# EAGLE design PIR_D205 (EAGLE 7.1.0)
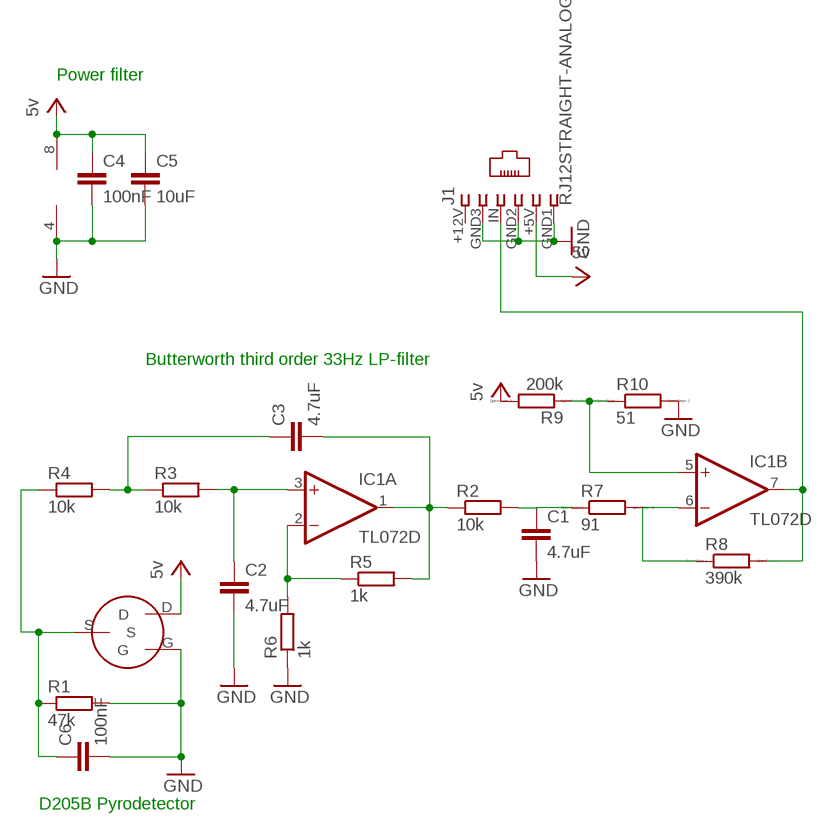
[diagram p0: schematic, sheet 1]

## Parts
C1  4.7uF  C-EUC1206  [C1206]
C2  4.7uF  C-EUC1206  [C1206]
C3  4.7uF  C-EUC1206  [C1206]
C4  100nF  C-EUC1206  [C1206]
C5  10uF  C-EUC1206  [C1206]
C6  100nF  C-EUC1206  [C1206]
IC1  TL072D  [SO08]
J1  RJ12STRAIGHT-ANALOG  [RJ12-STRAIGHT-ANALOG]
R1  47k  R-EU_R1206  [R1206]
R2  10k  R-EU_R0805  [R0805]
R3  10k  R-EU_R0805  [R0805]
R4  10k  R-EU_R0805  [R0805]
R5  1k  R-EU_R0805  [R0805]
R6  1k  R-EU_R0805  [R0805]
R7  91  R-EU_R1206  [R1206]
R8  390k  R-EU_R1206  [R1206]
R9  200k  R-EU_R1206  [R1206]
R10  51  R-EU_R1206  [R1206]
U$1  D205B  [TO5]

## Nets
GND: C1.2 C2.2 C4.2 C5.2 C6.2 IC1.4(P:V-) J1.GND1 J1.GND2 J1.GND3 R1.2 R6.1 R10.2 U$1.G
N$1: C6.1 R1.1 R4.1 U$1.S
N$2: C3.2 IC1.1(A:OUT) R2.1 R5.2
N$3: IC1.2(A:-IN) R5.1 R6.2
N$4: C1.1 R2.2 R7.1
N$5: C2.1 IC1.3(A:+IN) R3.2
N$6: C3.1 R3.1 R4.2
N$7: IC1.6(B:-IN) R7.2 R8.1
N$8: IC1.7(B:OUT) J1.IN R8.2
N$9: IC1.5(B:+IN) R9.1 R10.1
VCC: C4.1 C5.1 IC1.8(P:V+) J1.+5V R9.2 U$1.D ; supply symbol labelled 5v
Unconnected: J1.+12V

## Notes on the sheet
- Power filter
- Butterworth third order 33Hz LP-filter
- D205B Pyrodetector

## Library data of the parts
C1-C6 = rcl:C-EU: CAPACITOR, European symbol
IC1 = linear:TL072: OP AMP
J1 = lpatiny:RJ12: CORCOM Modular RJ Jacks No Shield Source: www.tycoelectronics.com .. ENG_DS_1654001_1099_RJ_L_0507.pdf
R1-R6 = rcl:R-EU_: RESISTOR, European symbol
R7-R10 = resistor:R-EU_: RESISTOR, European symbol; SPICEPREFIX: R
U$1 = lpatiny:D205B: Pyroelectric Infrared Radial Sensor 4.3V/W

## Net classes
0 default: width 0.5 mm
1 PWR: width 0.002 mm, drill 0.002 mm, clearance 0.002 mm

## Board
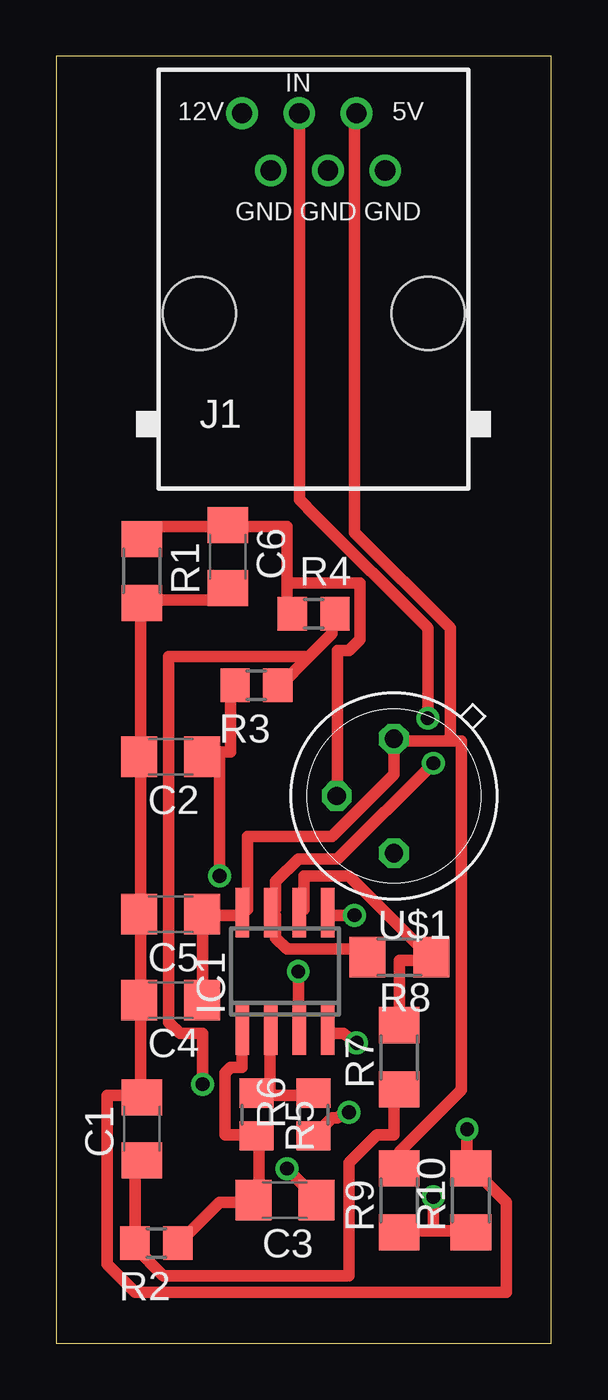
[diagram p1: board, top side]
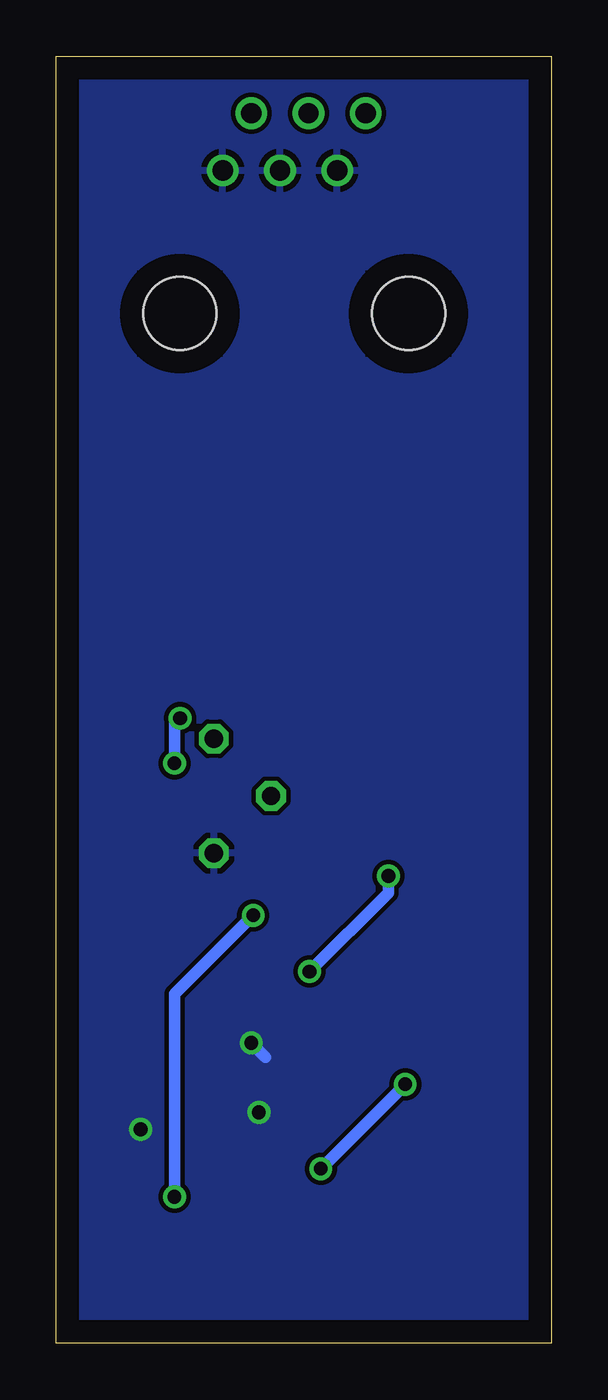
[diagram p2: board, bottom side, seen from below]

Size 22 x 57.14 mm. Coordinates in mm from the lower left corner, seen from the top.
Outline: 0,0 22,0 22,57.14 0,57.14 0,0
Copper layers (1*16): Top 0.035mm / dielectric 1.5mm / Bottom 0.035mm
Design rules "default": minimum track width 10mil, minimum drill 24mil, track to track 8mil, track to pad 8mil, pad to pad 8mil, via to via 8mil, smd to smd 8mil, copper to edge 40mil, drill to drill 8mil, minimum pad ring 10mil, minimum via ring 8mil, stop-mask expansion 4mil, vias tented up to drill 0mil, thermal gap 10mil

### Footprints (pad centres in the part's own frame; a part is rotated, then mirrored left to right if it is on the bottom)
C1206 = smd 1.6 x 1.8: 1 -1.4,0; 2 1.4,0
SO08 = smd 0.6 x 2.2: 1 -1.905,-2.6; 2 -0.635,-2.6; 3 0.635,-2.6; 4 1.905,-2.6; 5 1.905,2.6; 6 0.635,2.6; 7 -0.635,2.6; 8 -1.905,2.6
RJ12-STRAIGHT-ANALOG = drill 0.9 pad 1.4: +5V 1.905,8.89; +12V -3.175,8.89; GND1 3.175,6.35; GND2 0.635,6.35; GND3 -1.905,6.35; IN -0.635,8.89 | hole 3.251: -5.08,0; 5.08,0
R1206 = smd 1.6 x 1.803: 1 -1.422,0; 2 1.422,0
R0805 = smd 1.3 x 1.5: 1 -0.95,0; 2 0.95,0
TO5 = drill 0.813 octagon: D 0,-2.54; G 0,2.54; S 2.54,0

### Placement (x,y rotation side)
C1  3.81,9.53 90 top
C2  5.08,26.04 180 top
C3  10.16,6.35 180 top
C4  5.08,15.24 180 top
C5  5.08,19.05 180 top
C6  7.62,34.92 270 top
IC1  10.16,16.51 0 top
J1  11.43,45.72 0 top
R1  3.81,34.29 270 top
R2  4.45,4.45 180 top
R3  8.89,29.21 180 top
R4  11.43,32.38 0 top
R5  8.89,10.16 270 top
R6  11.43,10.16 90 top
R7  15.24,12.7 90 top
R8  15.24,17.14 180 top
R9  15.24,6.35 90 top
R10  18.41,6.35 90 top
U$1  15,24.3 180 top

### Tracks (layer width: path | path; a pad name or v marks a point on that pad's centre or on a via)
GND  (via drill 0.6, 0.61)
  Top 0.5: C6.2 7.5,33.5 7,33 4,33 R1.2 3.75,32.75 3.75,26.25 C2.2 3.75,26 3.75,19.25 C5.2 3.75,19 3.75,15.25 C4.2 3.75,15 3.75,11 C1.2 3.5,11 2.25,11 2.25,3.5 3.5,2.25 20,2.25 20,6.25 18.5,7.75 R10.2 18.25,8 v18.25,9.5 | R6.1 11.5,9.25 12.25,10 12.5,10 12.75,10.25 v13,10.25 | IC1.4 12.25,13.75 12.75,13.75 v13.34,13.34
  Bottom 0.5: v13.34,13.34 12.7,12.7
  pour Bottom: 0,57.15 22,57.15 22,0 0,0
N$1
  Top 0.5: 10.25,33.75 10.25,36.25 7.75,36.25 C6.1 7.5,36.25 4.5,36.25 4,35.75 R1.1 | 10.25,33.75 10.25,32.5 R4.1 | 10.25,33.75 13.5,33.75 13.5,31.25 13,30.75 12.5,30.75 12.5,24.5 U$1.S
N$2
  Top 0.5: R2.1 5.5,4.5 7.25,6.25 8.75,6.25 C3.2 9,6.5 9,9 R5.2 8.75,9.25 7.5,9.25 7.5,12 7.75,12.25 8.25,12.25 8.25,13.75 IC1.1
N$3
  Top 0.5: 9.5,11 11.25,11 R6.2 | 9.5,11 9,11 R5.1 9.5,11 | 9.5,11 9.5,13.75 IC1.2
N$4
  Top 0.5: C1.1 3.75,8 3.5,8 3.5,4.5 R2.2 3.5,4.25 4.75,3 13,3 13,8 14.25,9.25 15,9.25 15,11.25 R7.1
N$5  (via drill 0.61)
  Top 0.5: 7.25,26.25 6.5,26.25 C2.1 7.25,26.25 | 7.25,26.25 7.75,26.25 7.75,29 R3.2 | v10.75,16.5 10.75,14 IC1.3 | 7.25,26.25 v7.25,20.75
  Bottom 0.5: v10.75,16.5 7.25,20 v7.25,20.75
N$6  (via drill 0.61)
  Top 0.5: 11.12,30.38 12.25,31.5 12.25,32.25 R4.2 | 11.12,30.38 10,29.25 R3.1 | v10.25,7.75 11.5,6.5 C3.1 | v6.5,11.5 6.5,13.75 5.5,13.75 5,14.25 5,30.5 11,30.5 11.12,30.38
  Bottom 0.5: v6.5,11.5 v10.25,7.75
N$7
  Top 0.5: R7.2 15.25,14.25 15.25,17 16.5,17 R8.1 16.5,17.25 13,20.75 11,20.75 11,19.25 IC1.6
N$8  (via drill 0.61)
  Top 0.5: R8.2 13.75,17.25 13.5,17.5 10.25,17.5 9.75,18 9.75,19 IC1.7 9.75,19.25 9.75,20.5 10.75,21.5 12.5,21.5 v16.75,25.75 | v16.5,27.75 16.5,31.75 11.5,36.75 10.79,37.47 J1.IN 10.75,54.5
  Bottom 0.5: v16.5,27.75 16.75,27.5 v16.75,25.75
N$9  (via drill 0.61)
  Top 0.5: 16.75,5 18.25,5 R10.1 | 16.75,5 15.25,5 R9.1 | v13.25,19 12.25,19 IC1.5 | 16.75,5 v16.75,6.5
  Bottom 0.5: v13.25,19 16.75,15.5 v16.75,6.5
VCC
  Top 0.5: C4.1 6.5,15.25 6.5,19 C5.1 6.75,19 8.25,19 IC1.8 8.5,19.25 8.5,22.5 12.25,22.5 15,25.25 15,26.75 | 15,26.75 17.5,26.75 | 17.5,26.75 18,26.75 18,11.25 15.25,8.5 15.25,8 R9.2 | 17.5,26.75 17.5,31.75 13.25,36 13.25,54.5 J1.+5V | 15,26.75 U$1.D